# EasyEDA schematic schematic.easyeda.json
TITLE: Lunatic MIDI: Organ Registers/Pistons Node interface; REV: 1.0; Date: 2019-05-01; Sheet: 1/1; Drawn By: Marco Sacchi
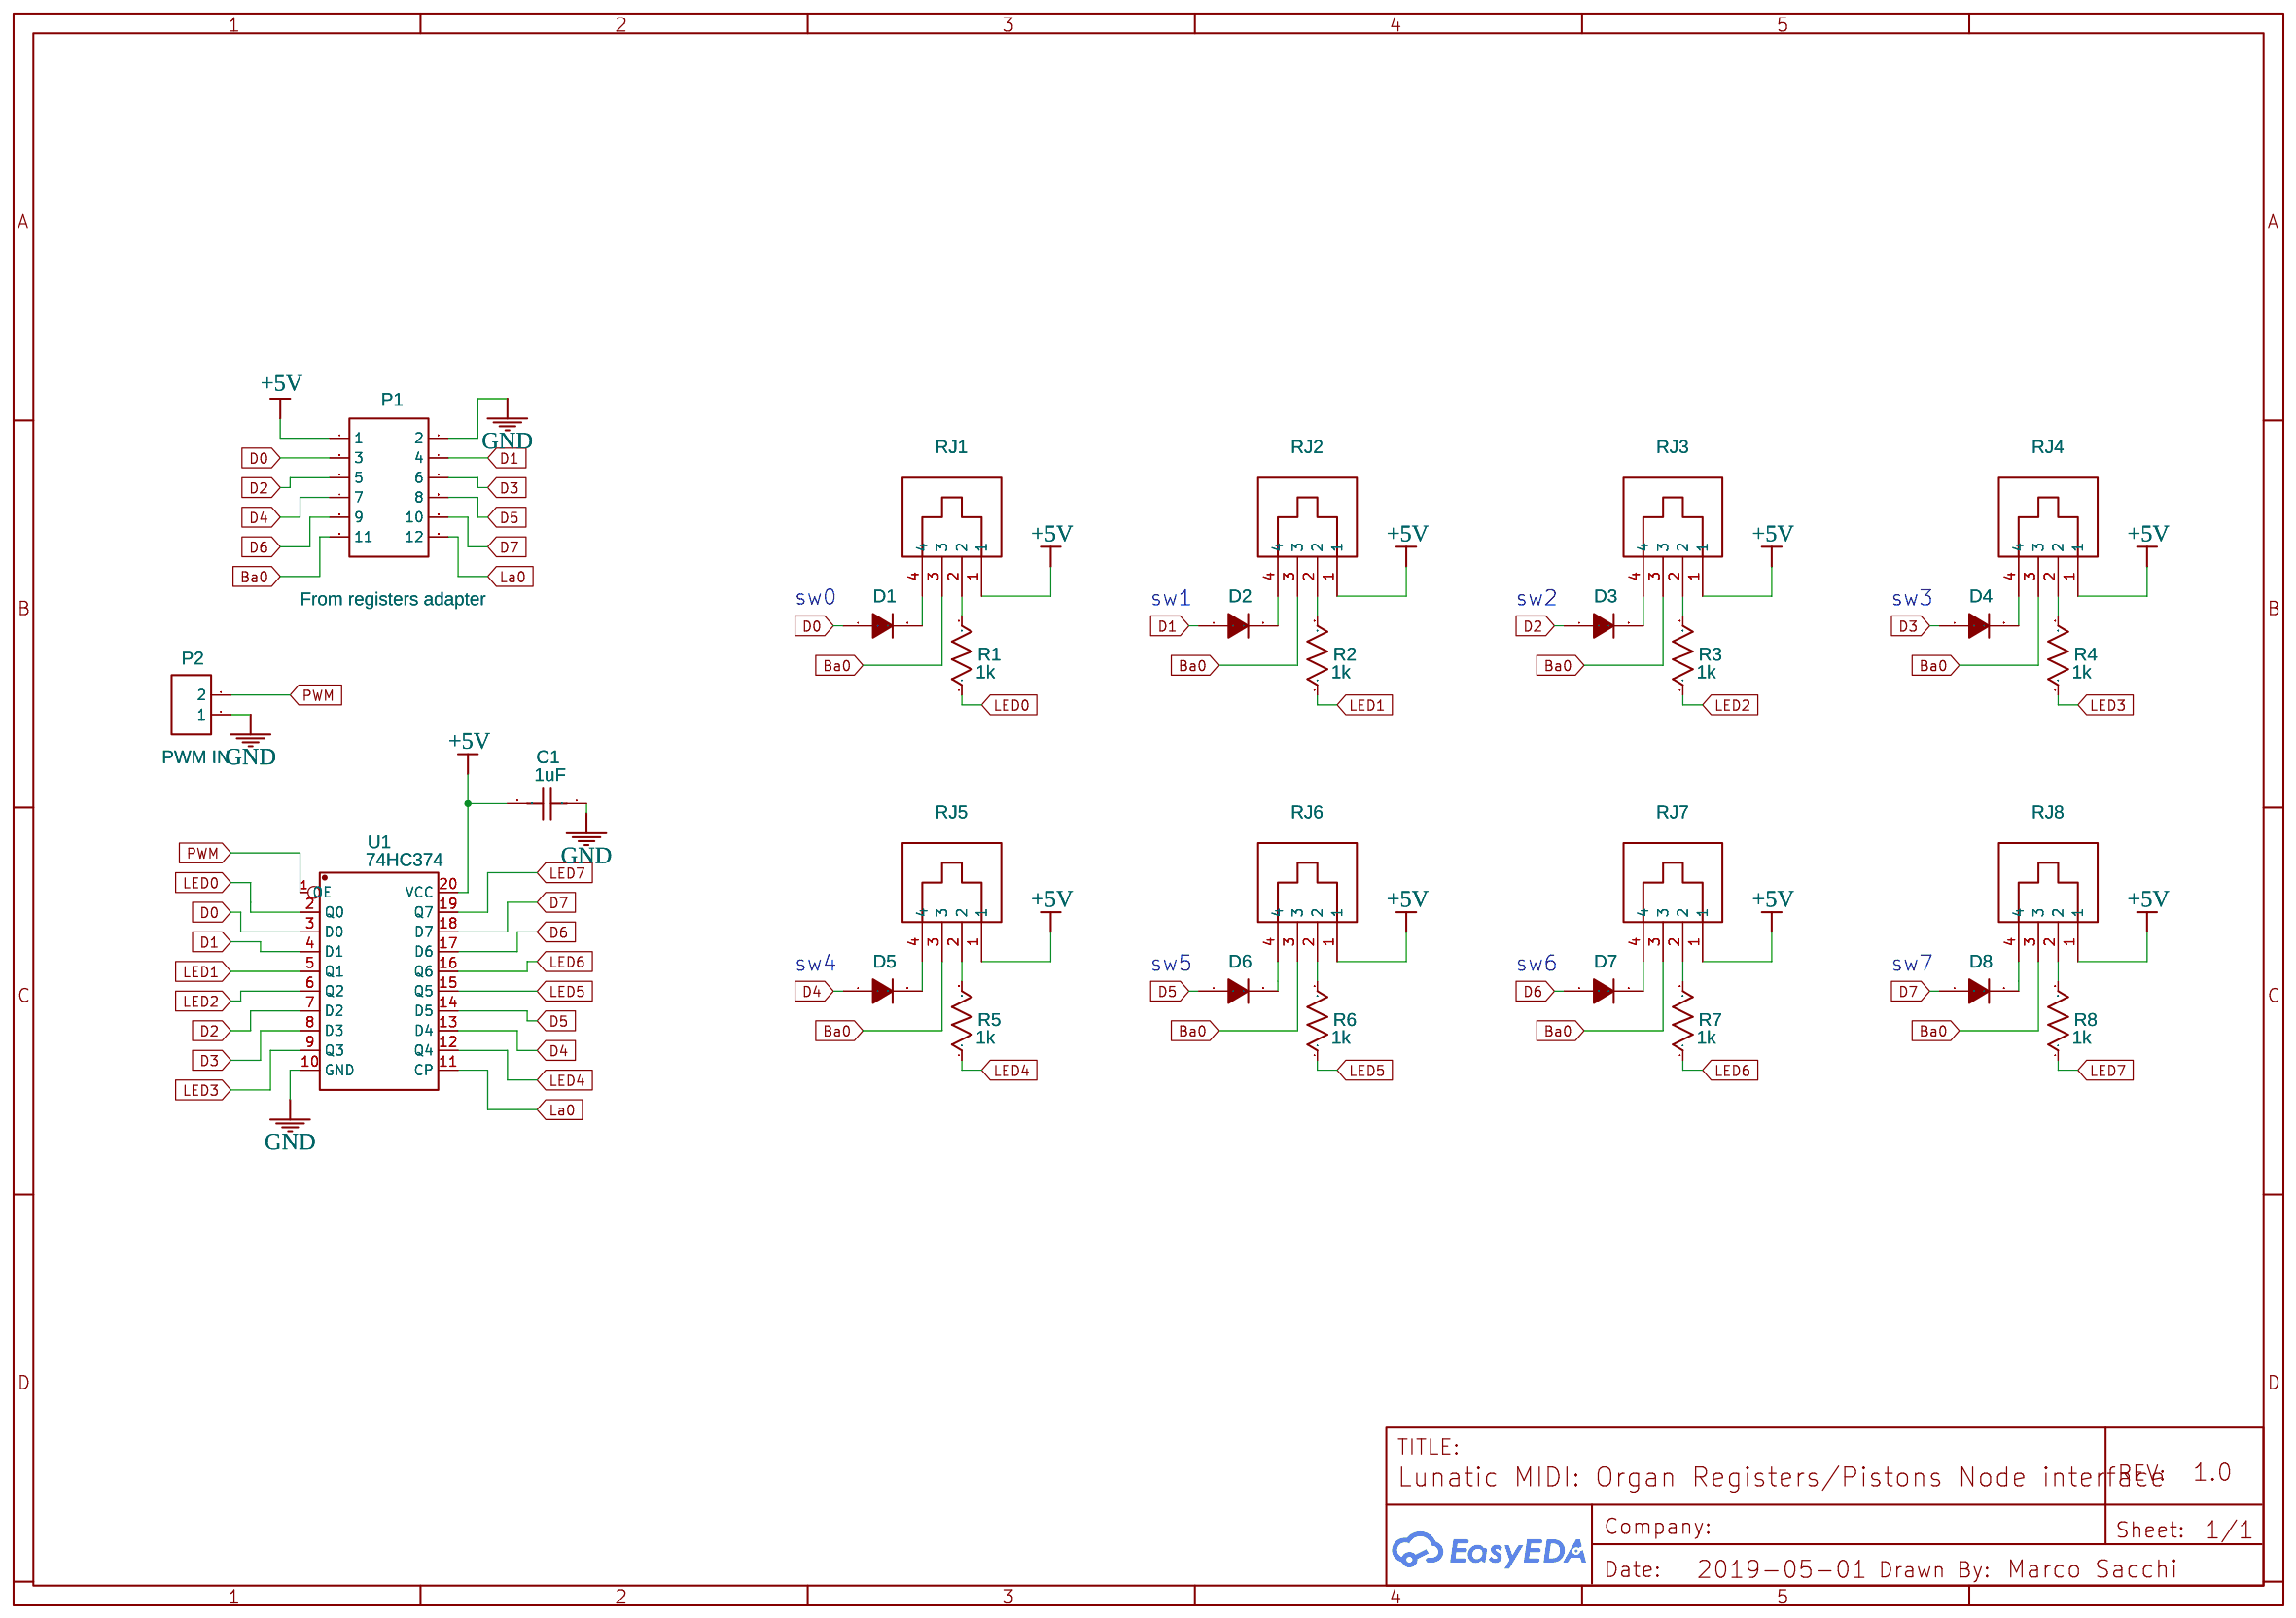
[diagram p0: schematic sheet]

## Parts
C1  1uF  [RAD-0.1]
D1  1N4148  [DO-35]
D2  1N4148  [DO-35]
D3  1N4148  [DO-35]
D4  1N4148  [DO-35]
D5  1N4148  [DO-35]
D6  1N4148  [DO-35]
D7  1N4148  [DO-35]
D8  1N4148  [DO-35]
P1  From registers adapter  [HDR-6X2/2.54-BBOX]
P2  PWM IN  [HDR-1X2/2.54]
R1  1k  [AXIAL-0.3]
R2  1k  [AXIAL-0.3]
R3  1k  [AXIAL-0.3]
R4  1k  [AXIAL-0.3]
R5  1k  [AXIAL-0.3]
R6  1k  [AXIAL-0.3]
R7  1k  [AXIAL-0.3]
R8  1k  [AXIAL-0.3]
RJ1  RJ22-4P4C-90  [RJ22-4P4C-90-AMP]
RJ2  RJ22-4P4C-90  [RJ22-4P4C-90-AMP]
RJ3  RJ22-4P4C-90  [RJ22-4P4C-90-AMP]
RJ4  RJ22-4P4C-90  [RJ22-4P4C-90-AMP]
RJ5  RJ22-4P4C-90  [RJ22-4P4C-90-AMP]
RJ6  RJ22-4P4C-90  [RJ22-4P4C-90-AMP]
RJ7  RJ22-4P4C-90  [RJ22-4P4C-90-AMP]
RJ8  RJ22-4P4C-90  [RJ22-4P4C-90-AMP]
U1  74HC374  [DIP-20]

## Library data of the parts
C1 = Cap_RAD-0.1_US: Manufacturer Part: ?
D1-D8 = -: Supplier: LCSC; Manufacturer: STARSEA; Supplier Part: C85057
P1 = -: Supplier: LCSC; Supplier Part: C66689; Manufacturer Part: ?
P2 = -: Supplier: LCSC; Manufacturer: BOOMELE; Manufacturer Part: 2.54-1*2PFemale; image: //image.lceda.cn/szlcsc/C49661.jpg; Supplier Part: C49661
R1-R8 = Res_AXIAL-0.3(1/8W)_US: Manufacturer Part: ?
RJ1-RJ8 = -: Supplier: RS-Online; Supplier Part: 615-4232; Manufacturer: TE Connectivity; Manufacturer Part: 1-1705949-1; Contributor: Lunatic electronics; Link: https://it.rs-online.com/web/p/connettori-rj22/6154232/
U1 = -: Manufacturer: TOSHIBA; Supplier Part: CD54; Contributor: Lunatic electronics

## Nets
+5V: C1.2 P1.1 RJ1.1 RJ2.1 RJ3.1 RJ4.1 RJ5.1 RJ6.1 RJ7.1 RJ8.1 U1.20(VCC)
GND: C1.1 P1.2 P2.1 U1.10(GND)
Ba0: P1.11 RJ1.3 RJ2.3 RJ3.3 RJ4.3 RJ5.3 RJ6.3 RJ7.3 RJ8.3
D0: D1.1(A) P1.3 U1.3(D0)
D1: D2.1(A) P1.4 U1.4(D1)
D2: D3.1(A) P1.5 U1.7(D2)
D3: D4.1(A) P1.6 U1.8(D3)
D4: D5.1(A) P1.7 U1.13(D4)
D5: D6.1(A) P1.8 U1.14(D5)
D6: D7.1(A) P1.9 U1.17(D6)
D7: D8.1(A) P1.10 U1.18(D7)
La0: P1.12 U1.11(CP)
LED0: R1.1 U1.2(Q0)
LED1: R2.1 U1.5(Q1)
LED2: R3.1 U1.6(Q2)
LED3: R4.1 U1.9(Q3)
LED4: R5.1 U1.12(Q4)
LED5: R6.1 U1.15(Q5)
LED6: R7.1 U1.16(Q6)
LED7: R8.1 U1.19(Q7)
PWM: P2.2 U1.1(OE)
Net-(D1-2): D1.2(K) RJ1.4
Net-(D2-2): D2.2(K) RJ2.4
Net-(D3-2): D3.2(K) RJ3.4
Net-(D4-2): D4.2(K) RJ4.4
Net-(D5-2): D5.2(K) RJ5.4
Net-(D6-2): D6.2(K) RJ6.4
Net-(D7-2): D7.2(K) RJ7.4
Net-(D8-2): D8.2(K) RJ8.4
Net-(R1-2): R1.2 RJ1.2
Net-(R2-2): R2.2 RJ2.2
Net-(R3-2): R3.2 RJ3.2
Net-(R4-2): R4.2 RJ4.2
Net-(R5-2): R5.2 RJ5.2
Net-(R6-2): R6.2 RJ6.2
Net-(R7-2): R7.2 RJ7.2
Net-(R8-2): R8.2 RJ8.2

## Notes on the sheet
- sw0
- sw1
- sw2
- sw3
- sw4
- sw5
- sw6
- sw7
